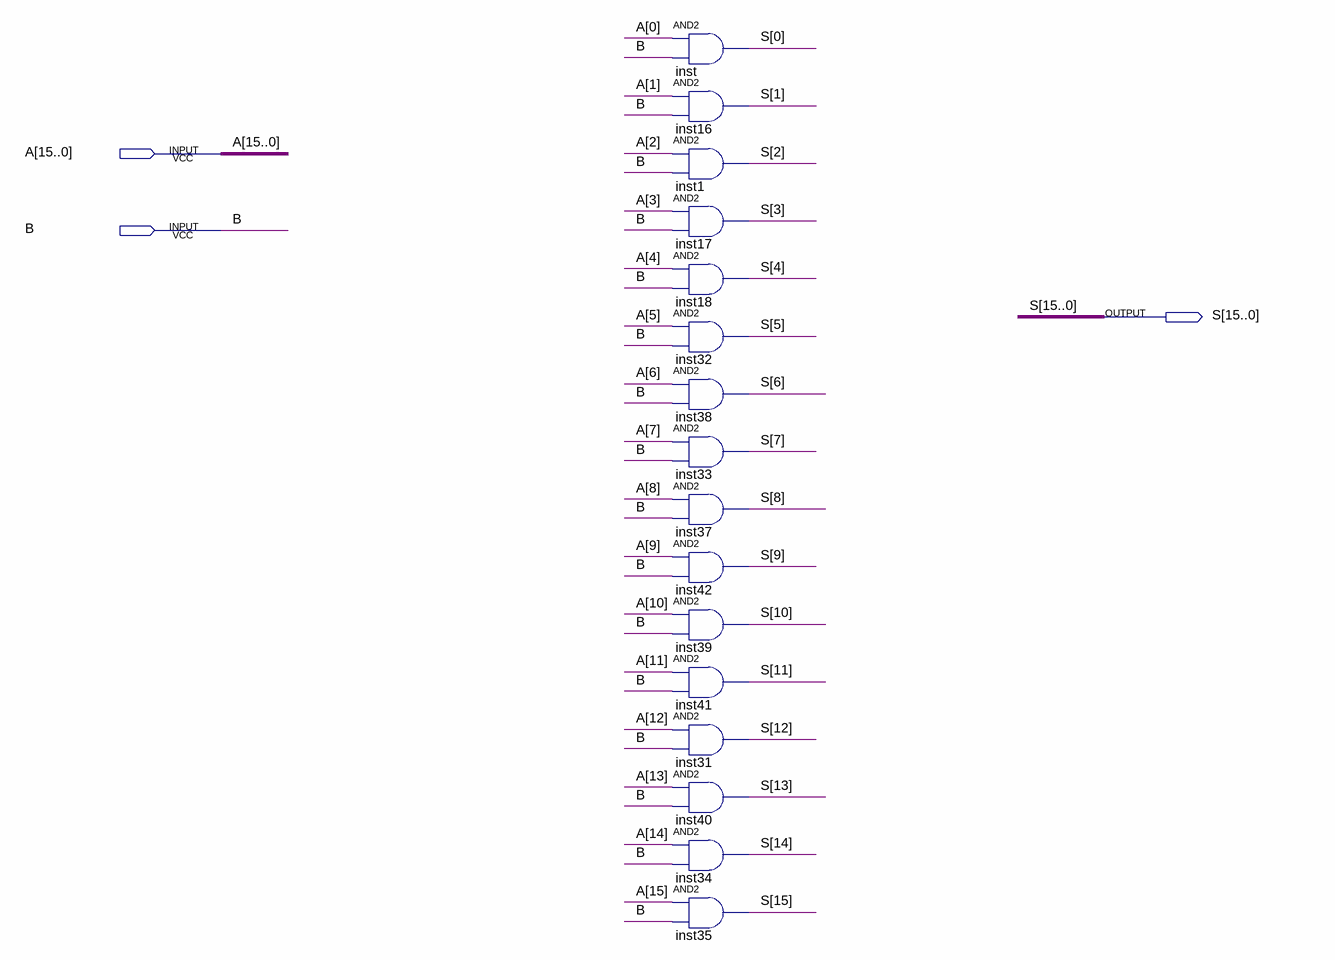
[diagram p0: schematic sheet]
// Quartus schematic updatedAND.bdf as structural Verilog: 16 symbols, 3 pins
module updatedAND (
  input  [15:0] A,
  input  B,
  output [15:0] S
);

  and inst (S[0], A[0], B);
  and inst16 (S[1], A[1], B);
  and inst1 (S[2], A[2], B);
  and inst17 (S[3], A[3], B);
  and inst18 (S[4], A[4], B);
  and inst32 (S[5], A[5], B);
  and inst38 (S[6], A[6], B);
  and inst33 (S[7], A[7], B);
  and inst37 (S[8], A[8], B);
  and inst42 (S[9], A[9], B);
  and inst39 (S[10], A[10], B);
  and inst41 (S[11], A[11], B);
  and inst31 (S[12], A[12], B);
  and inst40 (S[13], A[13], B);
  and inst34 (S[14], A[14], B);
  and inst35 (S[15], A[15], B);
endmodule
